# EAGLE design scs_shield (EAGLE 6.4)
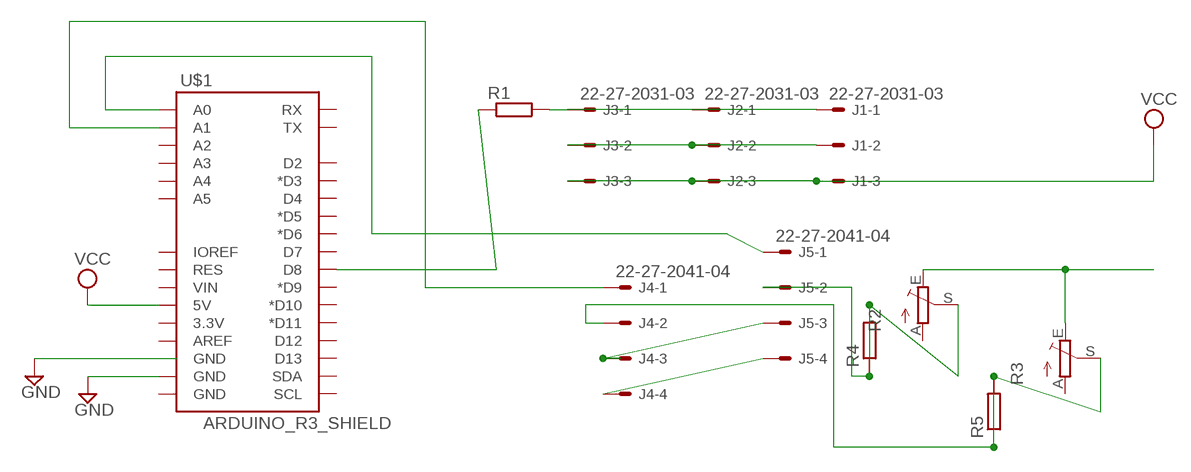
[diagram p0: schematic, sheet 1]

## Parts
J1  22-27-2031-03  [6410-03]
J2  22-27-2031-03  [6410-03]
J3  22-27-2031-03  [6410-03]
J4  22-27-2041-04  [6410-04]
J5  22-27-2041-04  [6410-04]
R1  R-EU_0204/5  [0204/5]
R2  TRIM_EU-CA6V  [CA6V]
R3  TRIM_EU-CA6V  [CA6V]
R4  R-EU_0204/5  [0204/5]
R5  R-EU_0204/5  [0204/5]
U$1  ARDUINO_R3_SHIELD  [UNO_R3_SHIELD]

## Nets
N$1: J1.1 J2.1 J3.1 R1.2
N$3: J4.2 R3.S R5.1 R5.2
N$4: R1.1 U$1.D8
N$5: J5.2 R2.S R4.1 R4.2
N$6: J5.1 U$1.A0
N$7: J4.1 U$1.A1
N$9: J4.3 J5.3 R2.E R3.E U$1.GND@1(GND) ; supply symbol labelled GND
N$10: J1.2 J2.2 J3.2
N$11: J4.4 J5.4
VCC: J1.3 J2.3 J3.3 U$1.5V
Unconnected: R2.A R3.A U$1.3.3V U$1.A2 U$1.A3 U$1.A4 U$1.A5 U$1.AREF U$1.D2 U$1.D3(*D3) U$1.D4 U$1.D5(*D5) U$1.D6(*D6) U$1.D7 U$1.D9(*D9) U$1.D10(*D10) U$1.D11(*D11) U$1.D12 U$1.D13 U$1.GND@0(GND) U$1.GND@2(GND) U$1.IOREF U$1.RES U$1.RX U$1.SCL U$1.SDA U$1.TX U$1.VIN

## Library data of the parts
J1-J3 = con-molex:22-?-03: CONNECTOR wire to board 2.54 mm (.1 inch) pitch header; OC_FARNELL: unknown; OC_NEWARK: unknown
J4 J5 = con-molex:22-?-04: CONNECTOR wire to board 2.54 mm (.1 inch) pitch header; OC_FARNELL: unknown; OC_NEWARK: unknown
R1 R4 R5 = resistor:R-EU_: RESISTOR, European symbol
R2 R3 = pot:TRIM_EU-: POTENTIOMETER
U$1 = SparkFun-Boards:ARDUINO_R3_SHIELD: Shield form compatible with the Arduino Uno R3.

## Board
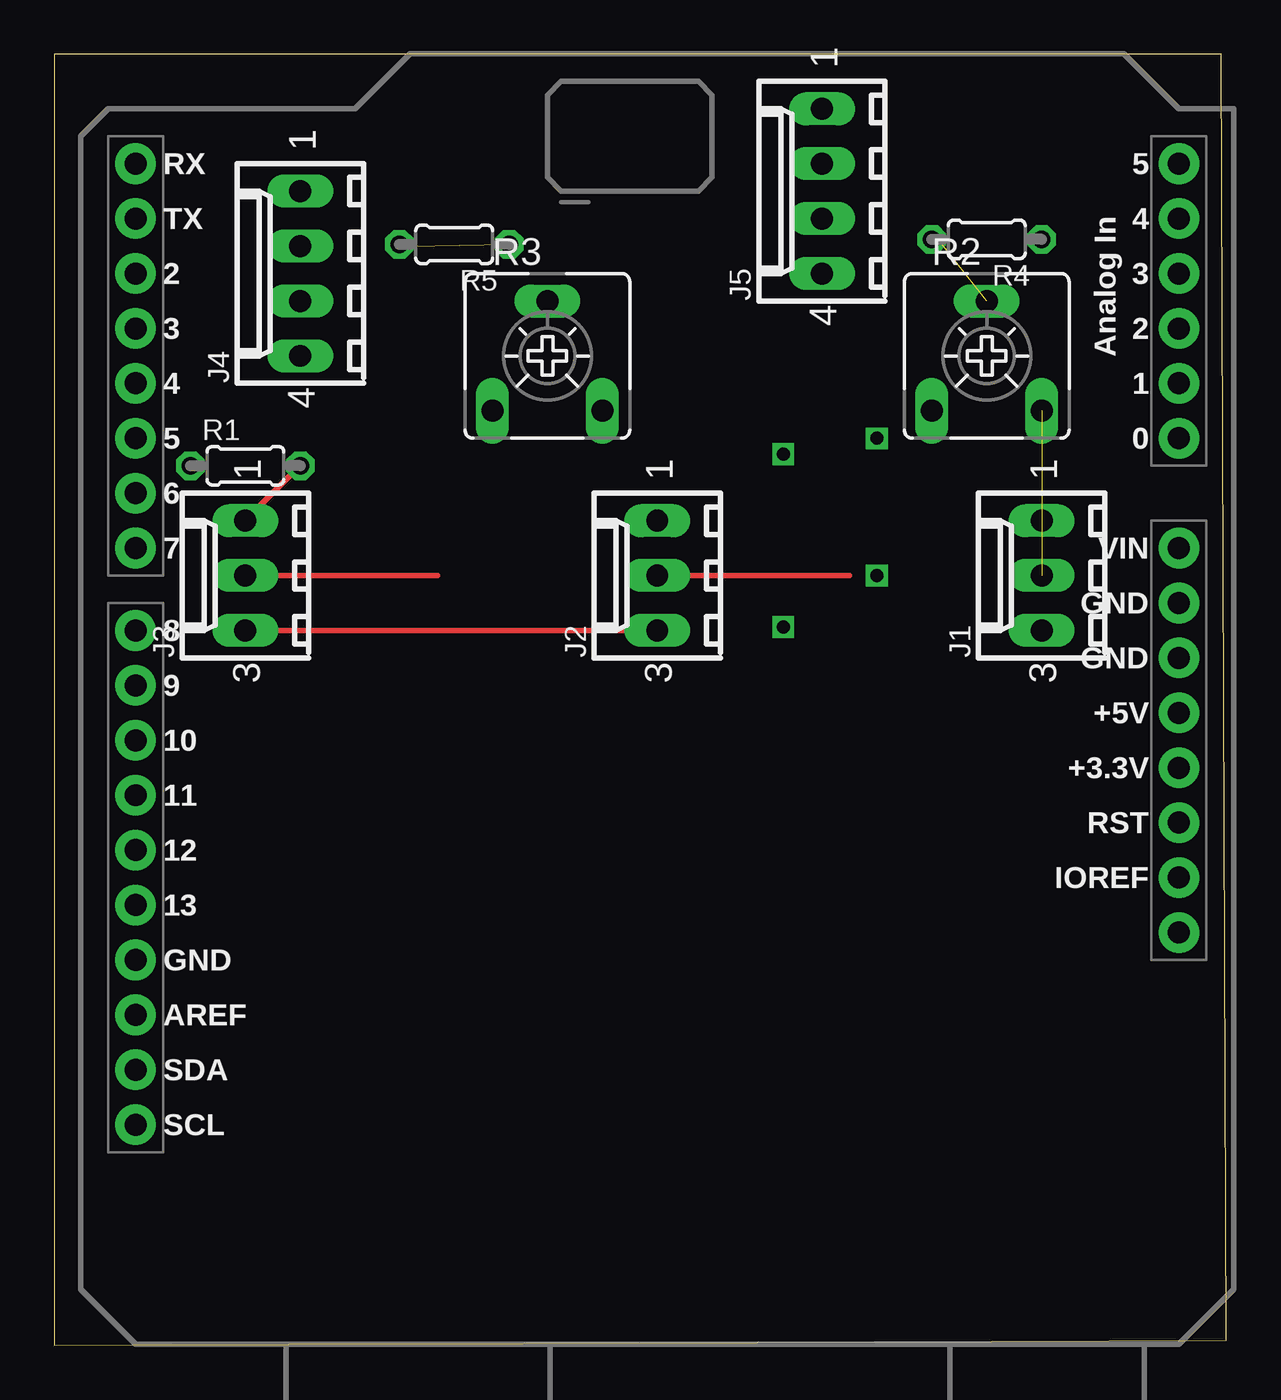
[diagram p1: board, top side]
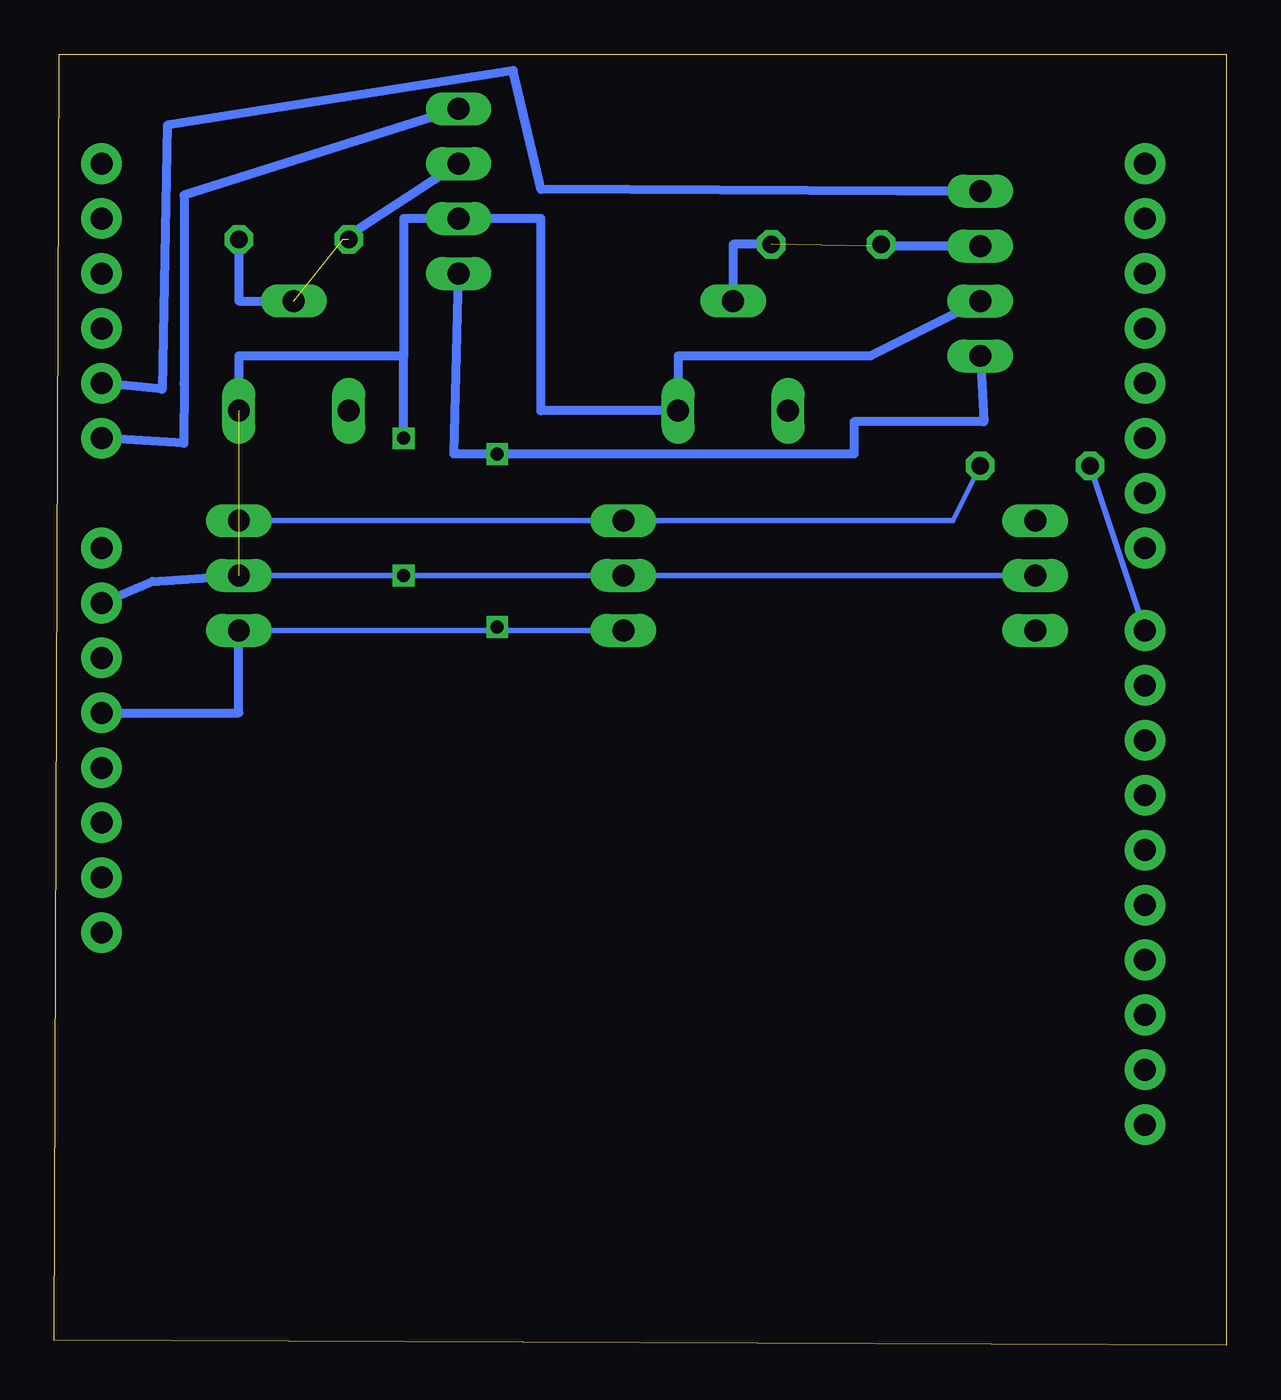
[diagram p2: board, bottom side, seen from below]

Size 54.23 x 59.73 mm. Coordinates in mm from the lower left corner, seen from the top.
Outline: 0,0 54.23,0.23 54,59.73 0,59.73 0,0
Copper layers (1*16): Top 0.035mm / dielectric 1.5mm / Bottom 0.035mm
Design rules "default": minimum track width 10mil, minimum drill 24mil, track to track 8mil, track to pad 8mil, pad to pad 8mil, via to via 8mil, smd to smd 8mil, copper to edge 40mil, drill to drill 8mil, minimum pad ring 10mil, minimum via ring 8mil, stop-mask expansion 4mil, vias tented up to drill 0mil, thermal gap 10mil

### Footprints (pad centres in the part's own frame; a part is rotated, then mirrored left to right if it is on the bottom)
6410-03 = drill 1.016 long: 1 2.54,0; 2 0,0; 3 -2.54,0
6410-04 = drill 1.016 long: 1 3.81,0; 2 1.27,0; 3 -1.27,0; 4 -3.81,0
0204/5 = drill 0.813 octagon: 1 -2.54,0; 2 2.54,0
CA6V = drill 1.016 long: A -2.54,-2.54; E 2.54,-2.54; S 0,2.54
UNO_R3_SHIELD = drill 1.016 pad 1.88: 3.3V 50.8,26.67; 5V 50.8,29.21; A0 50.8,41.91; A1 50.8,44.45; A2 50.8,46.99; A3 50.8,49.53; A4 50.8,52.07; A5 50.8,54.61; AREF 2.54,15.24; D2 2.54,49.53; D3 2.54,46.99; D4 2.54,44.45; D5 2.54,41.91; D6 2.54,39.37; D7 2.54,36.83; D8 2.54,33.02; D9 2.54,30.48; D10 2.54,27.94; D11 2.54,25.4; D12 2.54,22.86; D13 2.54,20.32; GND@0 50.8,31.75; GND@1 50.8,34.29; GND@2 2.54,17.78; IOREF 50.8,21.59; NC 50.8,19.05; RES 50.8,24.13; RX 2.54,54.61; SCL 2.54,10.16; SDA 2.54,12.7; TX 2.54,52.07; VIN 50.8,36.83

### Placement (x,y rotation side)
J1  45.68,35.61 90 top
J2  27.9,35.61 90 top
J3  8.85,35.61 90 top
J4  11.39,49.58 90 top
J5  35.52,53.39 90 top
R1  8.85,40.69 0 top
R2  43.14,45.77 0 top
R3  22.82,45.77 0 top
R4  43.14,51.16 180 top
R5  18.51,50.93 180 top
U$1  1.23,0.05 0 top

### Tracks (layer width: path | path; a pad name or v marks a point on that pad's centre or on a via)
N$1
  Top 0.254: J3.1 R1.2
  Bottom 0.254: R1.2 12.66,38.15 J2.1 J1.1
N$2  (via drill 0.6)
  other vias: 33.73,41.23
N$3  (1 unrouted)
  Bottom 0.406: J4.2 16.47,50.85 R5.2 | R5.1 22.82,50.93 R3.S
N$4
  Bottom 0.254: U$1.D8 R1.1
N$5  (via drill 0.61)  (2 unrouted)
  Bottom 0.406: J5.2 40.87,51.16 | R4.1 45.68,48.31 R2.S
  other vias: 45.68,51.16
N$6
  Bottom 0.406: J5.1 48.22,53.2 48.22,44.5 48.23,41.73 U$1.A0
N$7
  Bottom 0.406: J4.1 15.2,53.39 31.7,53.47 32.99,58.97 48.99,56.43 49.23,44.23 U$1.A1
N$8  (via drill 0.6)
  other vias: 33.73,33.23
N$9  (via drill 0.6)  (1 unrouted)
  Bottom 0.406: U$1.GND@1 49.68,35.34 45.68,35.61 | J4.3 16.47,45.77 25.36,45.77 R3.E 31.71,43.23 31.71,52.12 J5.3 38.06,52.12 38.06,45.77 | 38.06,45.77 45.68,45.77 R2.E | v38.06,41.96 38.06,45.77
N$10  (via drill 0.6)
  Top 0.254: 17.74,35.61 J3.2 | 36.79,35.61 J2.2
  Bottom 0.254: J1.2 v38.06,35.61 J2.2 J3.2
N$11
  Bottom 0.406: J4.4 11.23,42.73 17.23,42.73 17.23,41.23 35.73,41.23 J5.4
VCC
  Top 0.254: J2.3 J3.3
  Bottom 0.254: J2.3 J1.3
  Bottom 0.406: U$1.5V 45.68,29.26 J1.3